# Altium schematic sheet 2_MCU.SchDoc
size A3; Revision: 1.0; SheetNumber: 2; SheetTotal: 4
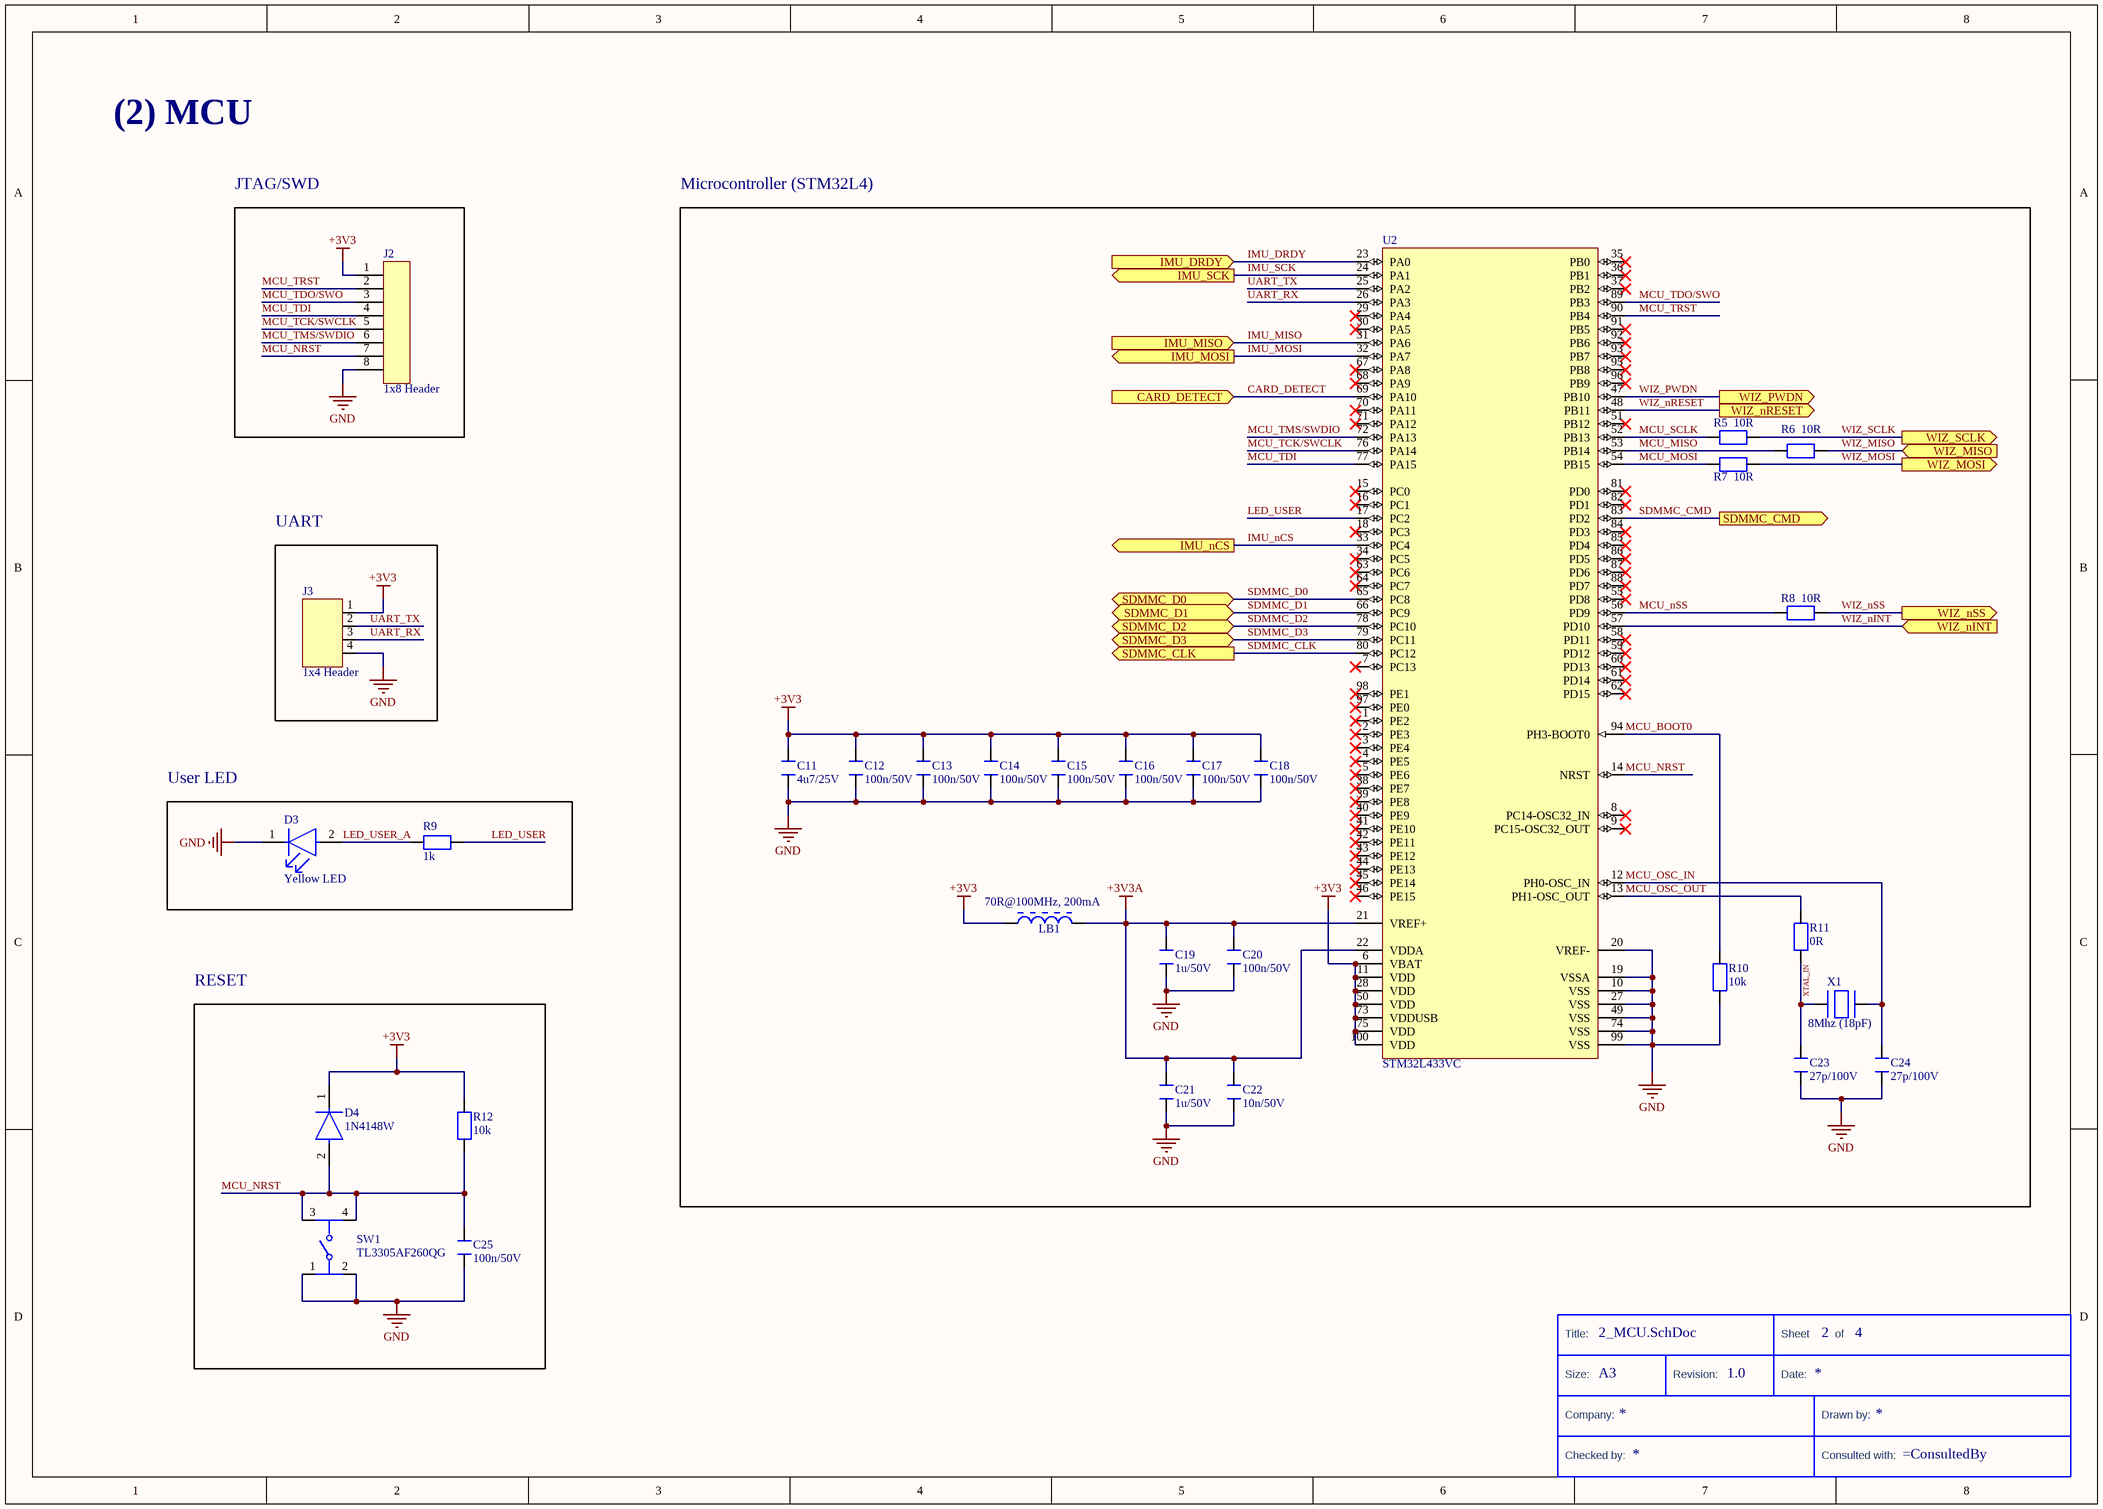
[diagram p0: 2_MCU.SchDoc]

## Parts
*  Size: A3  (hidden comment: TitleBlock)  (graphical)
C11  4u7/25V  [CAP_1206]
C12  100n/50V  [CAP_1206]
C13  100n/50V  [CAP_1206]
C14  100n/50V  [CAP_1206]
C15  100n/50V  [CAP_1206]
C16  100n/50V  [CAP_1206]
C17  100n/50V  [CAP_1206]
C18  100n/50V  [CAP_1206]
C19  1u/50V  [CAP_1206]
C20  100n/50V  [CAP_1206]
C21  1u/50V  [CAP_1206]
C22  10n/50V  [CAP_1206]
C23  27p/100V  [CAP_1206]
C24  27p/100V  [CAP_1206]
C25  100n/50V  [CAP_1206]
D3  Yellow LED  [FP-LTST-C150KSKT-MFG]
D4  1N4148W  [FP-SOD-123-IPC_A]
J2  1x8 Header  [1x8 Header]
J3  1x4 Header  [1x4 Header (Goldpin 2.54mm)]
LB1  70R@100MHz, 200mA  [MURA-BLM31A_L]
R5  10R  [RES_1206]
R6  10R  [RES_1206]
R7  10R  [RES_1206]
R8  10R  [RES_1206]
R9  1k  [RES_1206]
R10  10k  [RES_1206]
R11  0R  [RES_1206]
R12  10k  [RES_1206]
SW1  TL3305AF260QG  [FP-TL3305AF260QG-MFG]
U2  STM32L433VC  [LQFP100]
X1  8Mhz (18pF)  [XTAL-12.5x4.8]

## Blocks framed on the sheet
JTAG/SWD: J2
Microcontroller (STM32L4): C11-C24 LB1 R5-R8 R10 R11 U2 X1
UART: J3
User LED: D3 R9
RESET: C25 D4 R12 SW1

## Ports
CARD_DETECT (in), IMU_DRDY (in), IMU_MISO (in), IMU_MOSI (out), IMU_nCS (out), IMU_SCK (out), SDMMC_CLK (out), SDMMC_CMD (out), SDMMC_D0 (bidir), SDMMC_D1 (bidir), SDMMC_D2 (bidir), SDMMC_D3 (bidir), WIZ_MISO (in), WIZ_MOSI (out), WIZ_nINT (in), WIZ_nRESET (out), WIZ_nSS (out), WIZ_PWDN (out), WIZ_SCLK (out)

## Nets
+3V3: C11.2 C12.2 C13.2 C14.2 C15.2 C16.2 C17.2 C18.2 D4.1(C) J2.1 J3.1 LB1.1 R12.2 U2.6(VBAT) U2.11(VDD) U2.28(VDD) U2.50(VDD) U2.73(VDDUSB) U2.75(VDD) U2.100(VDD)
+3V3A: C19.2 C20.2 C21.2 C22.2 LB1.2 U2.21(VREF+) U2.22(VDDA)
GND: C11.1 C12.1 C13.1 C14.1 C15.1 C16.1 C17.1 C18.1 C19.1 C20.1 C21.1 C22.1 C23.1 C24.1 C25.1 D3.1(C) J2.8 J3.4 R10.1 SW1.1 SW1.2 U2.10(VSS) U2.19(VSSA) U2.20(VREF-) U2.27(VSS) U2.49(VSS) U2.74(VSS) U2.99(VSS)
CARD_DETECT: U2.69(PA10) ; port CARD_DETECT
IMU_DRDY: U2.23(PA0) ; port IMU_DRDY
IMU_MISO: U2.31(PA6) ; port IMU_MISO
IMU_MOSI: U2.32(PA7) ; port IMU_MOSI
IMU_nCS: U2.33(PC4) ; port IMU_nCS
IMU_SCK: U2.24(PA1) ; port IMU_SCK
LED_USER: R9.1 U2.17(PC2)
LED_USER_A: D3.2(A) R9.2
MCU_BOOT0: R10.2 U2.94(PH3-BOOT0)
MCU_MISO: R6.2 U2.53(PB14)
MCU_MOSI: R7.2 U2.54(PB15)
MCU_NRST: C25.2 D4.2(A) J2.7 R12.1 SW1.3 SW1.4 U2.14(NRST)
MCU_nSS: R8.2 U2.56(PD9)
MCU_OSC_IN: C24.2 U2.12(PH0-OSC_IN) X1.2
MCU_OSC_OUT: R11.1 U2.13(PH1-OSC_OUT)
MCU_SCLK: R5.2 U2.52(PB13)
MCU_TCK/SWCLK: J2.5 U2.76(PA14)
MCU_TDI: J2.4 U2.77(PA15)
MCU_TDO/SWO: J2.3 U2.89(PB3)
MCU_TMS/SWDIO: J2.6 U2.72(PA13)
MCU_TRST: J2.2 U2.90(PB4)
SDMMC_CLK: U2.80(PC12) ; port SDMMC_CLK
SDMMC_CMD: U2.83(PD2) ; port SDMMC_CMD
SDMMC_D0: U2.65(PC8) ; port SDMMC_D0
SDMMC_D1: U2.66(PC9) ; port SDMMC_D1
SDMMC_D2: U2.78(PC10) ; port SDMMC_D2
SDMMC_D3: U2.79(PC11) ; port SDMMC_D3
UART_RX: J3.3 U2.26(PA3)
UART_TX: J3.2 U2.25(PA2)
WIZ_MISO: R6.1 ; port WIZ_MISO
WIZ_MOSI: R7.1 ; port WIZ_MOSI
WIZ_nINT: U2.57(PD10) ; port WIZ_nINT
WIZ_nRESET: U2.48(PB11) ; port WIZ_nRESET
WIZ_nSS: R8.1 ; port WIZ_nSS
WIZ_PWDN: U2.47(PB10) ; port WIZ_PWDN
WIZ_SCLK: R5.1 ; port WIZ_SCLK
XTAL_IN: C23.2 R11.2 X1.1

Not connected (* = marked no-connect by the designer): U2 1(PE2)* 2(PE3)* 3(PE4)* 4(PE5)* 5(PE6)* 7(PC13)* 8(PC14-OSC32_IN)* 9(PC15-OSC32_OUT)* 15(PC0)* 16(PC1)* 18(PC3)* 29(PA4)* 30(PA5)* 34(PC5)* 35(PB0)* 36(PB1)* 37(PB2)* 38(PE7)* 39(PE8)* 40(PE9)* 41(PE10)* 42(PE11)* 43(PE12)* 44(PE13)* 45(PE14)* 46(PE15)* 51(PB12)* 55(PD8)* 58(PD11)* 59(PD12)* 60(PD13)* 61(PD14)* 62(PD15)* 63(PC6)* 64(PC7)* 67(PA8)* 68(PA9)* 70(PA11)* 71(PA12)* 81(PD0)* 82(PD1)* 84(PD3)* 85(PD4)* 86(PD5)* 87(PD6)* 88(PD7)* 91(PB5)* 92(PB6)* 93(PB7)* 95(PB8)* 96(PB9)* 97(PE0)* 98(PE1)*

## Notes on the sheet
- (2) MCU
- (in symbol TitleBlock) Title:; Sheet; of; Size:; Revision:; Date:; Company:; Drawn by:; Checked by:; Consulted with:

## Library data of the parts
* = TitleBlock: Standard Title Block
C11-C25 = CAP_1206: Generic 1206/3216 capacitor
D3 = CMP-2000-06618-2: LED YELLOW CLEAR 1206 SMD; Power Rating: 75mW; Wavelength: 588nm; Forward Current: 30mA; Test Current: 20mA; Viewing Angle: 130°; Forward Voltage: 2.4V; Luminous Intensity: 60mcd; Lens Style: Diffused; Number of Elements: 1; Reverse Voltage: 5V; Lens Color: Colorless; Dominant Wavelength: 587nm; Mount: Surface Mount; Min Operating Temperature: -55°C; Depth: 1.6mm; Max Operating Temperature: 85°C; Color: Yellow; Power Dissipation: 75mW; Width: 1.6mm; Packaging: Tape and Reel; Length: 3.2mm; Illumination Color: Yellow; Number of Pins: 2; Case Code (Metric): 3216; Lead Free: Lead Free; Package Quantity: 1; Radiation Hardening: No; Height: 1.1mm; Case Code (Imperial): 1206; Number of LEDs: 1; Case/Package: 1206; Lens Transparency: Clear
D4 = CMP-2000-04993-2: DIODE GEN PURP 100V 150MA SOD123; Max Reverse Leakage Current: 5uA; Max Surge Current: 2A; Reverse Recovery Time: 4ns; Polarity: Standard; Capacitance: 4pF; Max Forward Surge Current (Ifsm): 1A; Element Configuration: Single; Power Dissipation: 400mW; Forward Voltage: 1V; Radiation Hardening: No; Lead Free: Lead Free; Max Reverse Voltage (DC): 100V; Current Rating: 150mA; Forward Current: 150mA; Packaging: Tape and Reel; Number of Pins: 2; Package Quantity: 3000; Max Operating Temperature: 150°C; Min Operating Temperature: -65°C; Average Rectified Current: 150mA; Recovery Time: 4ns; Output Current: 150mA; Peak Non-Repetitive Surge Current: 2A; Width: 1.8mm; Voltage Rating (DC): 100V; Height: 1.2mm; Max Repetitive Reverse Voltage (Vrrm): 100V; Mount: Surface Mount; Length: 2.85mm
J2 = 1x8 Header: 1x8 Header,Through Hole (Goldpin 2.54m)
J3 = 1x4 Header (Goldpin 2.54mm): 1x4 Header,Through Hole (Goldpin 2.54mm)
LB1 = CMP-2000-05955-1: Chip Bead, 100 MHz, 200 mA, -55 to 125 degC, 2-Pin SMD (1206), RoHS, Tape and Reel; Manufacturer: Murata; Brand: MurataElectronics; Case Height: 1.1mm; Maximum DC Resistance: 150mOhms; Case Length: 3.2mm; Tolerance: 25%; Case Width: 1.6mm; Impedance: 70Ohms; Test Frequency: 100MHz; Product Category: EMIFilterBeads,Chips&Arrays; Series: BLM31A; Manufacturer URL: http://www.murata.com/; Mounting Technology: SurfaceMount; Package / Case: 1206(3216metric); Product: FerriteChipBeads; Package Reference: 1206; Packaging: Reel; Dimensions: 1.6mmWx3.2mmLx1.1mmH; Maximum DC Current: 200mA; Operating Temperature Range: -55Cto+125C; RoHS: Details; Package Description: 2-Pin Surface Mount Device, Body 3.2 x 1.6 mm; Termination Style: SMD/SMT; Datasheet URL: http://www.mouser.com/ds/2/281/L0110S0100BLM31A_SP-767397.pdf; Datasheet Version: 11/2007; Factory Pack Quantity: 2500
R5-R12 = RES_1206: Generic 1206/3216 resistor
SW1 = CMP-17879-000010-1: SWITCH TACTILE SPST-NO 50MA 12V; Mechanical Life: 200000Cycles; Switch Function: Off-Mom; Actuator Type: Standard; Operating Force: 260gf; Illumination Type: Non-Illuminated; Switch Travel: 0.2mm; Throw Configuration: SPST; Min Operating Temperature: -20°C; Max Operating Temperature: 70°C; Lead Free: Lead Free; Mount: Surface Mount; Packaging: Tape and Reel; Termination: Gull Wing
U2 = STM32L433VC: STM32L433RC, 80MHz, Coretx-M4
X1 = XTAL-8MHz